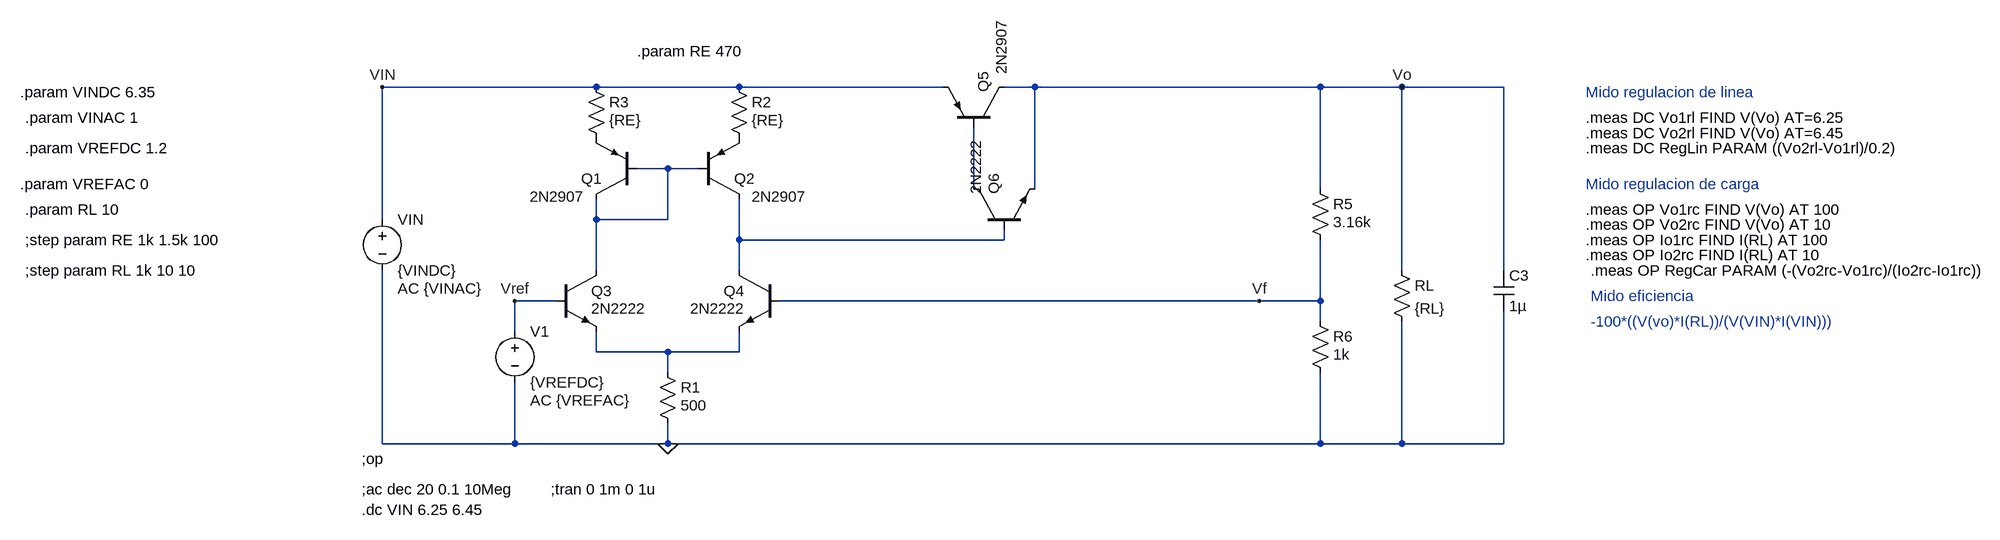
[diagram p0: schematic Regulador_LDOA_v1_Cuasi_Darlington.asc]
Regulador_LDOA_v1_Cuasi_Darlington.asc, the LTspice schematic file:
Version 4
SHEET 1 2316 856
WIRE -4704 -608 -5040 -608
WIRE -4480 -608 -4704 -608
WIRE -4160 -608 -4480 -608
WIRE -4016 -608 -4064 -608
WIRE -3568 -608 -4016 -608
WIRE -3440 -608 -3568 -608
WIRE -3280 -608 -3440 -608
WIRE -4592 -480 -4640 -480
WIRE -4544 -480 -4592 -480
WIRE -4112 -448 -4112 -544
WIRE -4016 -448 -4016 -608
WIRE -3568 -448 -3568 -608
WIRE -5040 -400 -5040 -608
WIRE -4704 -400 -4704 -432
WIRE -4592 -400 -4592 -480
WIRE -4592 -400 -4704 -400
WIRE -4480 -368 -4480 -432
WIRE -4064 -368 -4064 -384
WIRE -4064 -368 -4480 -368
WIRE -4704 -320 -4704 -400
WIRE -4480 -320 -4480 -368
WIRE -3440 -320 -3440 -608
WIRE -3280 -320 -3280 -608
WIRE -4768 -272 -4832 -272
WIRE -3664 -272 -4416 -272
WIRE -3568 -272 -3568 -368
WIRE -3568 -272 -3664 -272
WIRE -3568 -240 -3568 -272
WIRE -4832 -224 -4832 -272
WIRE -4704 -192 -4704 -224
WIRE -4592 -192 -4704 -192
WIRE -4480 -192 -4480 -224
WIRE -4480 -192 -4592 -192
WIRE -4592 -160 -4592 -192
WIRE -5040 -48 -5040 -320
WIRE -4832 -48 -4832 -144
WIRE -4832 -48 -5040 -48
WIRE -4592 -48 -4592 -80
WIRE -4592 -48 -4832 -48
WIRE -3568 -48 -3568 -160
WIRE -3568 -48 -4592 -48
WIRE -3440 -48 -3440 -240
WIRE -3440 -48 -3568 -48
WIRE -3280 -48 -3280 -256
WIRE -3280 -48 -3440 -48
FLAG -4592 -48 0
FLAG -3440 -608 Vo
FLAG -4832 -272 Vref
FLAG -5040 -608 VIN
FLAG -3664 -272 Vf
DATAFLAG -3600 -608 ""
DATAFLAG -4176 -272 ""
SYMBOL pnp -4640 -432 R180
WINDOW 3 84 4 Left 2
SYMATTR Value 2N2907
SYMATTR InstName Q1
SYMBOL pnp -4544 -432 M180
WINDOW 3 84 4 Left 2
SYMATTR Value 2N2907
SYMATTR InstName Q2
SYMBOL npn -4768 -320 R0
WINDOW 3 56 60 Left 2
SYMATTR Value 2N2222
SYMATTR InstName Q3
SYMBOL npn -4416 -320 M0
WINDOW 3 56 60 Left 2
SYMATTR Value 2N2222
SYMATTR InstName Q4
SYMBOL res -4608 -176 R0
WINDOW 3 36 68 Left 2
SYMATTR Value 500
SYMATTR InstName R1
SYMBOL pnp -4064 -544 M270
WINDOW 3 84 4 Left 2
SYMATTR Value 2N2907
SYMATTR InstName Q5
SYMBOL npn -4112 -384 R270
WINDOW 3 56 4 Left 2
SYMATTR Value 2N2222
SYMATTR InstName Q6
SYMBOL res -3584 -464 R0
WINDOW 3 36 68 Left 2
SYMATTR Value 3.16k
SYMATTR InstName R5
SYMBOL res -3584 -256 R0
WINDOW 3 36 68 Left 2
SYMATTR Value 1k
SYMATTR InstName R6
SYMBOL res -3456 -336 R0
SYMATTR InstName RL
SYMATTR Value {RL}
SYMBOL voltage -4832 -240 R0
WINDOW 123 24 124 Left 2
WINDOW 39 0 0 Left 0
SYMATTR Value2 AC {VREFAC}
SYMATTR InstName V1
SYMATTR Value {VREFDC}
SYMBOL voltage -5040 -416 R0
WINDOW 123 24 124 Left 2
WINDOW 39 0 0 Left 0
SYMATTR Value2 AC {VINAC}
SYMATTR InstName VIN
SYMATTR Value {VINDC}
SYMBOL res -4720 -624 R0
WINDOW 3 36 68 Left 2
SYMATTR Value {RE}
SYMATTR InstName R3
SYMBOL res -4496 -624 R0
WINDOW 3 36 68 Left 2
SYMATTR Value {RE}
SYMATTR InstName R2
SYMBOL cap -3296 -320 R0
SYMATTR InstName C3
SYMATTR Value 1µ
TEXT -5072 -24 Left 2 !;op
TEXT -5072 24 Left 2 !;ac dec 20 0.1 10Meg
TEXT -5608 -600 Left 2 !.param VINDC 6.35
TEXT -5600 -560 Left 2 !.param VINAC 1
TEXT -5600 -512 Left 2 !.param VREFDC 1.2
TEXT -5608 -456 Left 2 !.param VREFAC 0
TEXT -5600 -416 Left 2 !.param RL 10
TEXT -5072 56 Left 2 !.dc VIN 6.25 6.45
TEXT -5600 -368 Left 2 !;step param RE 1k 1.5k 100
TEXT -4640 -664 Left 2 !.param RE 470
TEXT -5600 -320 Left 2 !;step param RL 1k 10 10
TEXT -3152 -600 Left 2 ;Mido regulacion de linea
TEXT -3152 -560 Left 2 !.meas DC Vo1rl FIND V(Vo) AT=6.25
TEXT -3152 -536 Left 2 !.meas DC Vo2rl FIND V(Vo) AT=6.45
TEXT -3152 -512 Left 2 !.meas DC RegLin PARAM ((Vo2rl-Vo1rl)/0.2)
TEXT -3152 -456 Left 2 ;Mido regulacion de carga
TEXT -3152 -416 Left 2 !.meas OP Vo1rc FIND V(Vo) AT 100
TEXT -3152 -392 Left 2 !.meas OP Vo2rc FIND V(Vo) AT 10
TEXT -3152 -368 Left 2 !.meas OP Io1rc FIND I(RL) AT 100
TEXT -3152 -344 Left 2 !.meas OP Io2rc FIND I(RL) AT 10
TEXT -3144 -280 Left 2 ;Mido eficiencia
TEXT -3144 -240 Left 2 ;-100*((V(vo)*I(RL))/(V(VIN)*I(VIN)))
TEXT -3144 -320 Left 2 !.meas OP RegCar PARAM (-(Vo2rc-Vo1rc)/(Io2rc-Io1rc))
TEXT -4776 24 Left 2 !;tran 0 1m 0 1u

The netlist it stands for:
* Regulador_LDOA_v1_Cuasi_Darlington.asc
Q1 N001 N001 P001 0 2N2907
Q2 N003 N001 P002 0 2N2907
Q3 N001 Vref N004 0 2N2222
Q4 N003 Vf N004 0 2N2222
R1 N004 0 500
Q5 Vo N002 VIN 0 2N2907
Q6 N002 N003 Vo 0 2N2222
R5 Vo Vf 3.16k
R6 Vf 0 1k
RL Vo 0 {RL}
V1 Vref 0 {VREFDC} AC {VREFAC}
VIN VIN 0 {VINDC} AC {VINAC}
R3 VIN P001 {RE}
R2 VIN P002 {RE}
C3 Vo 0 1µ
.model NPN NPN
.model PNP PNP
.lib standard.bjt
;op
;ac dec 20 0.1 10Meg
.param VINDC 6.35
.param VINAC 1
.param VREFDC 1.2
.param VREFAC 0
.param RL 10
.dc VIN 6.25 6.45
;step param RE 1k 1.5k 100
.param RE 470
;step param RL 1k 10 10
* Mido regulacion de linea
.meas DC Vo1rl FIND V(Vo) AT=6.25
.meas DC Vo2rl FIND V(Vo) AT=6.45
.meas DC RegLin PARAM ((Vo2rl-Vo1rl)/0.2)
* Mido regulacion de carga
.meas OP Vo1rc FIND V(Vo) AT 100
.meas OP Vo2rc FIND V(Vo) AT 10
.meas OP Io1rc FIND I(RL) AT 100
.meas OP Io2rc FIND I(RL) AT 10
* Mido eficiencia
* -100*((V(vo)*I(RL))/(V(VIN)*I(VIN)))
.meas OP RegCar PARAM (-(Vo2rc-Vo1rc)/(Io2rc-Io1rc))
;tran 0 1m 0 1u
.backanno
.end